# EAGLE design geigerCounter (EAGLE 5.11)
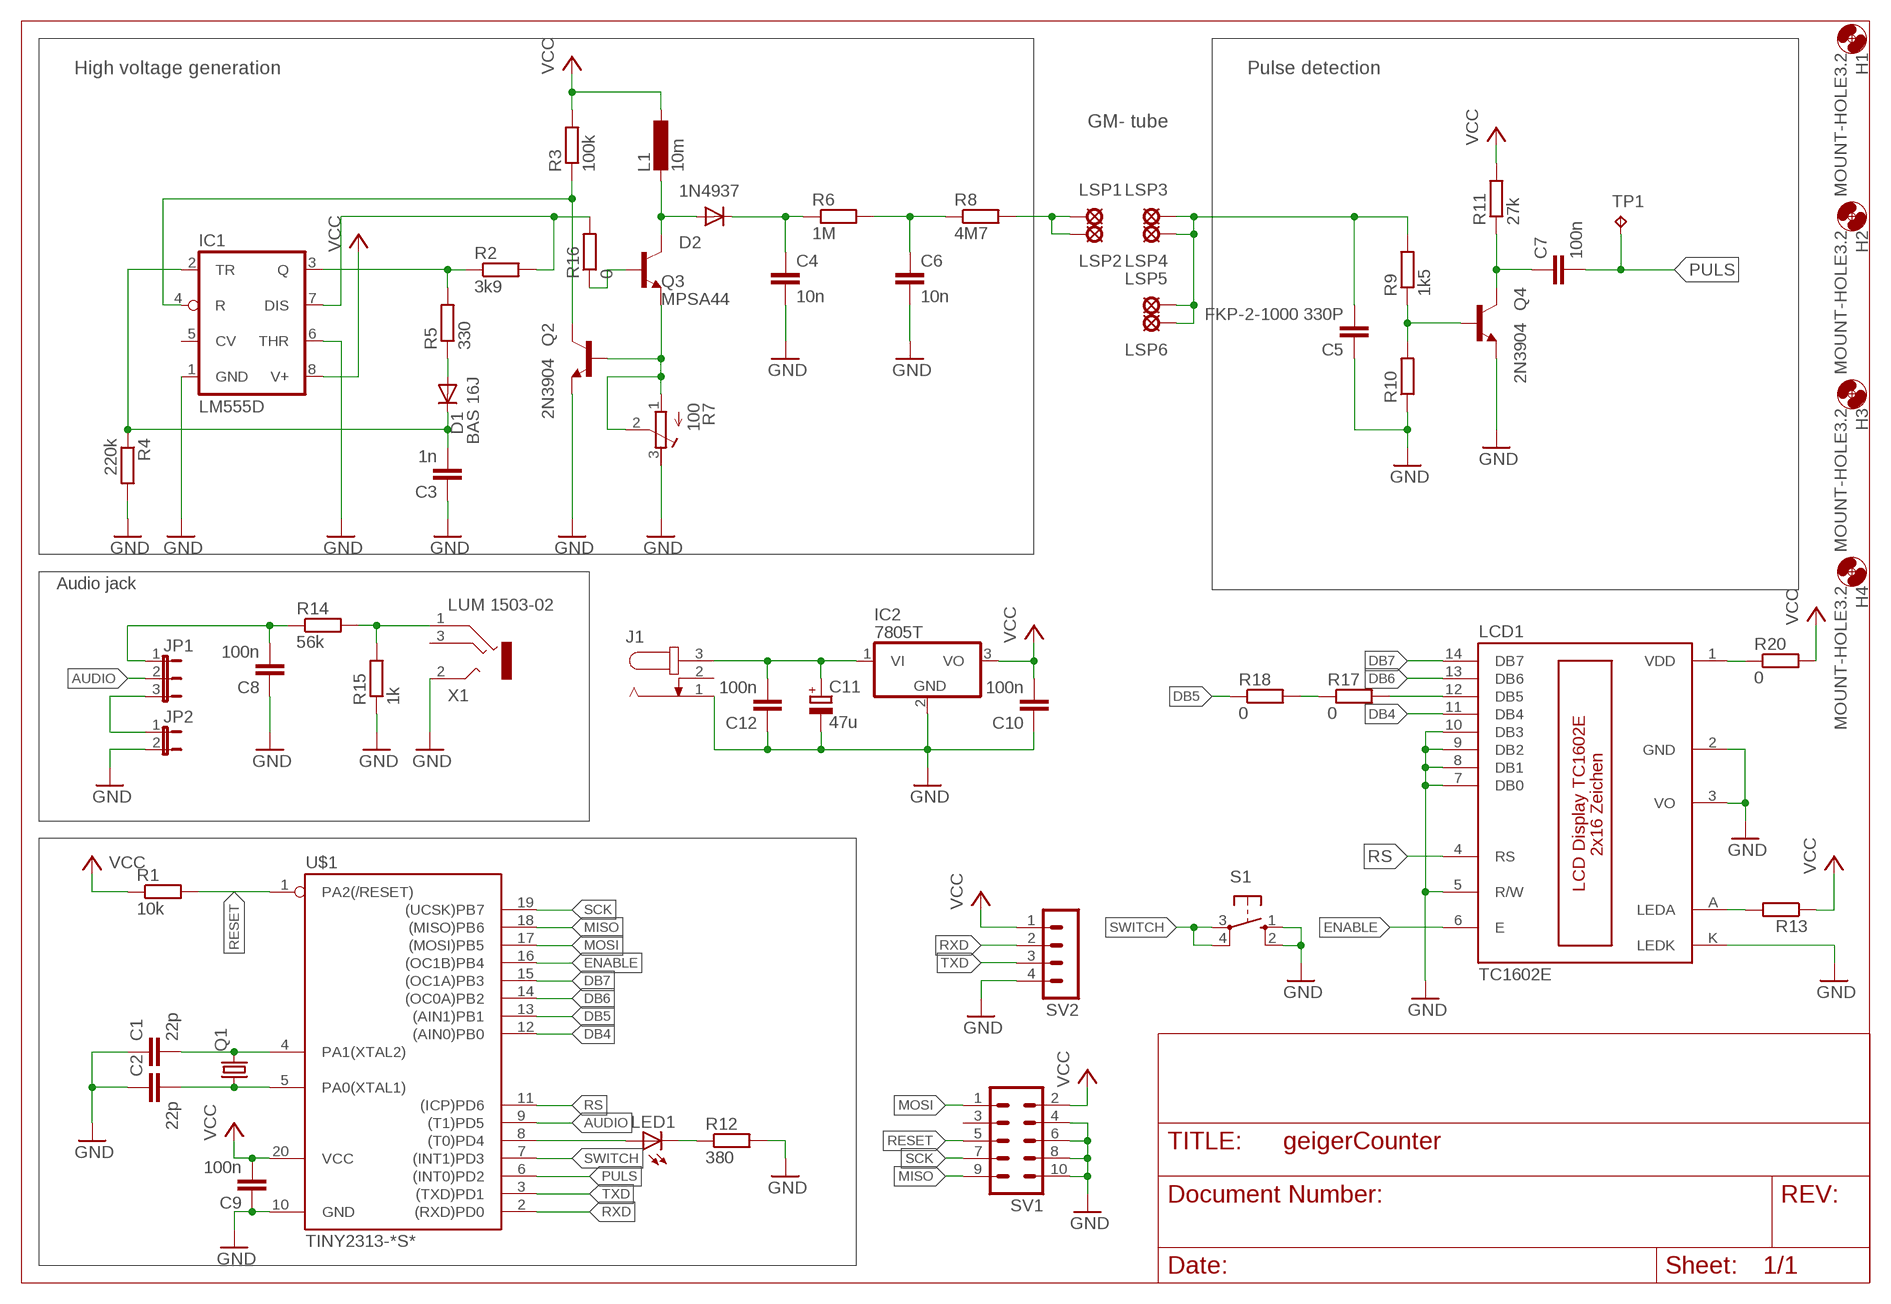
[diagram p0: schematic, sheet 1]

## Parts
C1  22p  C-EUC0805  [C0805]
C2  22p  C-EUC0805  [C0805]
C3  1n  C-EUC0805  [C0805]
C4  10n  C15/7  [C15B7]
C5  FKP-2-1000 330P  C5/5  [C5B5]
C6  10n  C15/7  [C15B7]
C7  100n  C-EUC0805  [C0805]
C8  100n  C-EUC0805  [C0805]
C9  100n  C-EUC0805  [C0805]
C10  100n  C-EUC0805  [C0805]
C11  47u  CPOL-EUUD-5X5,8  [UD-5X5,8_NICHICON]
C12  100n  C-EUC0805  [C0805]
D1  BAS 16J  DIODE-SOD323-W  [SOD323-W]
D2  1N4937  1N4942  [DO41-10]
H1  MOUNT-HOLE3.2  [3,2]
H2  MOUNT-HOLE3.2  [3,2]
H3  MOUNT-HOLE3.2  [3,2]
H4  MOUNT-HOLE3.2  [3,2]
IC1  LM555D  [SO08]
IC2  7805T  [TO220H]
J1  JACK-PLUG1  [SPC4078]
JP1  JP2E  [JP2]
JP2  JP1E  [JP1]
L1  10m  L-EU0207/5V  [0207/5V]
LCD1  TC1602E  [TC1602E]
LED1  LEDCHIP-LED0805  [CHIP-LED0805]
LSP1  PL 120000  SE14  [SE14]
LSP2  PL 120000  SE14  [SE14]
LSP3  PL 120000  SE14  [SE14]
LSP4  PL 120000  SE14  [SE14]
LSP5  PL 120000  SE14  [SE14]
LSP6  PL 120000  SE14  [SE14]
Q1  CRYSTALHC49UP  [HC49UP]
Q2  2N3904  [TO92]
Q3  MPSA44  2N3904  [TO92]
Q4  2N3904  [TO92]
R1  10k  R-EU_R0805  [R0805]
R2  3k9  R-EU_R0805  [R0805]
R3  100k  R-EU_R0805  [R0805]
R4  220k  R-EU_R0805  [R0805]
R5  330  R-EU_R0805  [R0805]
R6  1M  R-EU_0204/7  [0204/7]
R7  100  R-TRIMM64Y  [RTRIM64Y]
R8  4M7  R-EU_0204/7  [0204/7]
R9  1k5  R-EU_0204/7  [0204/7]
R10  R-EU_0204/7  [0204/7]
R11  27k  R-EU_R0805  [R0805]
R12  380  R-EU_R0805  [R0805]
R13  R-EU_R0805  [R0805]
R14  56k  R-EU_R0805  [R0805]
R15  1k  R-EU_R0805  [R0805]
R16  0  R-EU_R0805  [R0805]
R17  0  R-EU_R0805  [R0805]
R18  0  R-EU_R0805  [R0805]
R20  0  R-EU_R0805  [R0805]
S1  10-XX  [B3F-10XX]
SV1  MA05-2  [MA05-2]
SV2  MA04-1  [MA04-1]
TP1  TPTP15SQ  [TP15SQ]
U$1  TINY2313-*S*  [SO20L$]
X1  LUM 1503-02  1503_02  [1503_02]

## Nets
$345: C7.1 Q4.1(C) R11.1
AUDIO: JP1.2 U$1.9((T1)PD5)
DB4: LCD1.11(DB4) U$1.12((AIN0)PB0)
DB5: R18.1 U$1.13((AIN1)PB1)
DB6: LCD1.13(DB6) U$1.14((OC0A)PB2)
DB7: LCD1.14(DB7) U$1.15((OC1A)PB3)
ENABLE: LCD1.6(E) U$1.16((OC1B)PB4)
GND: C1.1 C2.1 C3.1 C4.2 C5.1 C6.2 C8.1 C9.1 C10.1 C11.- C12.1 IC1.1(GND) IC1.6(THR) IC2.2(GND) J1.1 JP2.2 LCD1.2(GND) LCD1.3(VO) LCD1.5(R/W) LCD1.7(DB0) LCD1.8(DB1) LCD1.9(DB2) LCD1.10(DB3) LCD1.K(LEDK) Q2.3(E) Q4.3(E) R4.2 R7.3(A) R10.1 R12.2 R15.1 S1.1(S) S1.2(S1) SV1.4 SV1.6 SV1.8 SV1.10 SV2.4 U$1.10(GND) X1.2
MISO: SV1.9 U$1.18((MISO)PB6)
MOSI: SV1.1 U$1.17((MOSI)PB5)
N$1: C6.1 R6.2 R8.1
N$2: IC1.3(Q) R2.1 R5.2
N$3: LCD1.A(LEDA) R13.2
N$4: LED1.A U$1.8((T0)PD4)
N$5: IC1.7(DIS) R2.2 R16.2
N$6: IC1.4(R) Q2.1(C) R3.1
N$7: LED1.C R12.1
N$8: D1.A R5.1
N$9: JP1.3 JP2.1
N$10: LSP1.MP LSP2.MP R8.2
N$11: C5.2 LSP3.MP LSP4.MP LSP5.MP LSP6.MP R9.2
N$12: Q4.2(B) R9.1 R10.2
N$13: D2.A L1.2 Q3.1(C)
N$14: Q2.2(B) Q3.3(E) R7.1(E) R7.2(S)
N$16: C8.2 JP1.1 R14.1
N$17: C4.1 D2.C R6.1
N$18: C3.2 D1.C IC1.2(TR) R4.1
N$19: C2.2 Q1.1 U$1.5(PA0(XTAL1))
N$20: C1.2 Q1.2 U$1.4(PA1(XTAL2))
N$21: C11.+ C12.2 IC2.1(VI) J1.3
N$22: R14.2 R15.2 X1.1
N$23: Q3.2(B) R16.1
N$24: LCD1.12(DB5) R17.2
N$25: R17.1 R18.2
N$26: LCD1.1(VDD) R20.1
PULS: C7.2 TP1.TP U$1.6((INT0)PD2)
RESET: R1.2 SV1.5 U$1.1(PA2(/RESET))
RS: LCD1.4(RS) U$1.11((ICP)PD6)
RXD: SV2.2 U$1.2((RXD)PD0)
SCK: SV1.7 U$1.19((UCSK)PB7)
SWITCH: S1.3(P) S1.4(P1) U$1.7((INT1)PD3)
TXD: SV2.3 U$1.3((TXD)PD1)
VCC: C9.2 C10.2 IC1.8(V+) IC2.3(VO) L1.1 R1.1 R3.2 R11.2 R13.1 R20.2 SV1.2 SV2.1 U$1.20(VCC)
Unconnected: IC1.5(CV) J1.2 SV1.3 X1.2@2 X1.3

## Notes on the sheet
- High voltage generation | Pulse detection
- GM- tube
- Audio jack

## Library data of the parts
C1-C3 C7-C10 C12 = rcl:C-EU: CAPACITOR, European symbol
C4-C6 = capacitor-wima:C: CAPACITOR naming: grid - package width
C11 = rcl:CPOL-EU: POLARIZED CAPACITOR, European symbol
D1 = diode:DIODE-: DIODE
D2 = diode:1N4942: DIODE 1.0 A, 200 V, 150 ns
H1-H4 = holes:MOUNT-HOLE: MOUNTING HOLE with drill center marker
IC1 = linear:*555: TIMER
IC2 = linear:78*: Positive VOLTAGE REGULATOR Source: http://cache.national.com/ds/LM/LM78L05.pdf http://www.fairchildsemi.com/ds/LM/LM7805.pdf
J1 = con-jack:JACK-PLUG: DC POWER JACK Power Jack, DC, Right Angle, Through Hole, Rated 5A at 16VDC, PC Terminals Distributor: Farnell (www.Farnell.de) Drawing: 84N1161.pdf / 84N1162.pdf Manufacturer: SPC Technology (www.spctechnology.com) Type: SPC4077 / SPC 4078; OC_FARNELL: unknown; OC_NEWARK: unknown
JP1 = jumper:JP2E: JUMPER
JP2 = jumper:JP1E: JUMPER
L1 = rcl:L-EU: INDUCTOR, European symbol
LCD1 = tc1602e_l:TC1602E: LCD Anzeige TC1602E(L) © Dipl. Päd. Otmar Hettrich-Keller 11/08 o.hettrich-keller@htl-leonding.ac.at Datenblatt: http://www.lcd-module.de/deu/pdf/doma/dip162-d.pdf
LED1 = led:LED: LED OSRAM: - CHIPLED LG R971, LG N971, LY N971, LG Q971, LY Q971, LO R971, LY R971 LH N974, LH R974 LS Q976, LO Q976, LY Q976 LO Q996 - Hyper CHIPLED LW Q18S LB Q993, LB Q99A, LB R99A - SideLED LS A670, LO A670, LY A670, LG A670, LP A670 LB A673, LV A673, LT A673, LW A673 LH A674 LY A675 LS A676, LA A676, LO A676, LY A676, LW A676 LS A679, LY A679, LG A679 - Hyper Micro SIDELED® LS Y876, LA Y876, LO Y876, LY Y876 LT Y87S - SmartLED LW L88C, LW L88S LB L89C, LB L89S, LG L890 LS L89K, LO L89K, LY L89K LS L896, LA L896, LO L896, LY L896 - TOPLED LS T670, LO T670, LY T670, LG T670, LP T670 LSG T670, LSP T670, LSY T670, LOP T670, LYG T670 LG T671, LOG T671, LSG T671 LB T673, LV T673, LT T673, LW T673 LH T674 LS T676, LA T676, LO T676, LY T676, LB T676, LH T676, LSB T676, LW T676 LB T67C, LV T67C, LT T67C, LS T67K, LO T67K, LY T67K, LW E67C LS E67B, LA E67B, LO E67B, LY E67B, LB E67C, LV E67C, LT E67C LW T67C LS T679, LY T679, LG T679 LS T770, LO T770, LY T770, LG T770, LP T770 LB T773, LV T773, LT T773, LW T773 LH T774 LS E675, LA E675, LY E675, LS T675 LS T776, LA T776, LO T776, LY T776, LB T776 LHGB T686 LT T68C, LB T68C - Hyper Mini TOPLED® LB M676 - Mini TOPLED Santana® LG M470 LS M47K, LO M47K, LY M47K Source: http://www.osram.convergy.de LUXEON: - LUMILED® LXK2-PW12-R00, LXK2-PW12-S00, LXK2-PW14-U00, LXK2-PW14-V00 LXK2-PM12-R00, LXK2-PM12-S00, LXK2-PM14-U00 LXK2-PE12-Q00, LXK2-PE12-R00, LXK2-PE12-S00, LXK2-PE14-T00, LXK2-PE14-U00 LXK2-PB12-K00, LXK2-PB12-L00, LXK2-PB12-M00, LXK2-PB14-N00, LXK2-PB14-P00, LXK2-PB14-Q00 LXK2-PR12-L00, LXK2-PR12-M00, LXK2-PR14-Q00, LXK2-PR14-R00 LXK2-PD12-Q00, LXK2-PD12-R00, LXK2-PD12-S00 LXK2-PH12-R00, LXK2-PH12-S00 LXK2-PL12-P00, LXK2-PL12-Q00, LXK2-PL12-R00 Source: www.luxeon.com KINGBRIGHT: KA-3528ASYC Source: www.kingbright.com
LSP1-LSP6 = solpad:SE14: SOLDER PAD E1553, drill 1,4mm, distributor Buerklin, 07F820
Q1 = crystal:CRYSTAL: CRYSTAL; OC_FARNELL: unknown; OC_NEWARK: unknown
Q2-Q4 = transistor-npn:2N3904: NPN Transistor
R1-R6 R8-R18 R20 = rcl:R-EU_: RESISTOR, European symbol
R7 = rcl:R-TRIMM: Trimm resistor
S1 = switch-omron:10-XX: OMRON SWITCH; MPN: B3F-1000; OC_FARNELL: 176432; OC_NEWARK: 36M3542
SV1 = con-lstb:MA05-2: PIN HEADER; OC_FARNELL: unknown; OC_NEWARK: unknown
SV2 = con-lstb:MA04-1: PIN HEADER; OC_FARNELL: unknown; OC_NEWARK: unknown
TP1 = testpad:TP: Test pad
U$1 = avr-7:TINY2313*: Atmel Tiny2313 2K Flash, 128 bytes EEPROM, 128 bytes RAM
X1 = con-lumberg:1503_02: Jack connectors according to JISC 6560, 3.5 mm Klinkeneinbaukupplung nach JISC 6560, 3,5 mm, 3-polig/stereo, abgewinkelte Ausführung, Surface-Mount-Technik (SMT) Source: http://www.lumberg.com/Produkte/PDFs/1503_02.pdf; OC_FARNELL: 1216979; OC_NEWARK: unknown

## Board
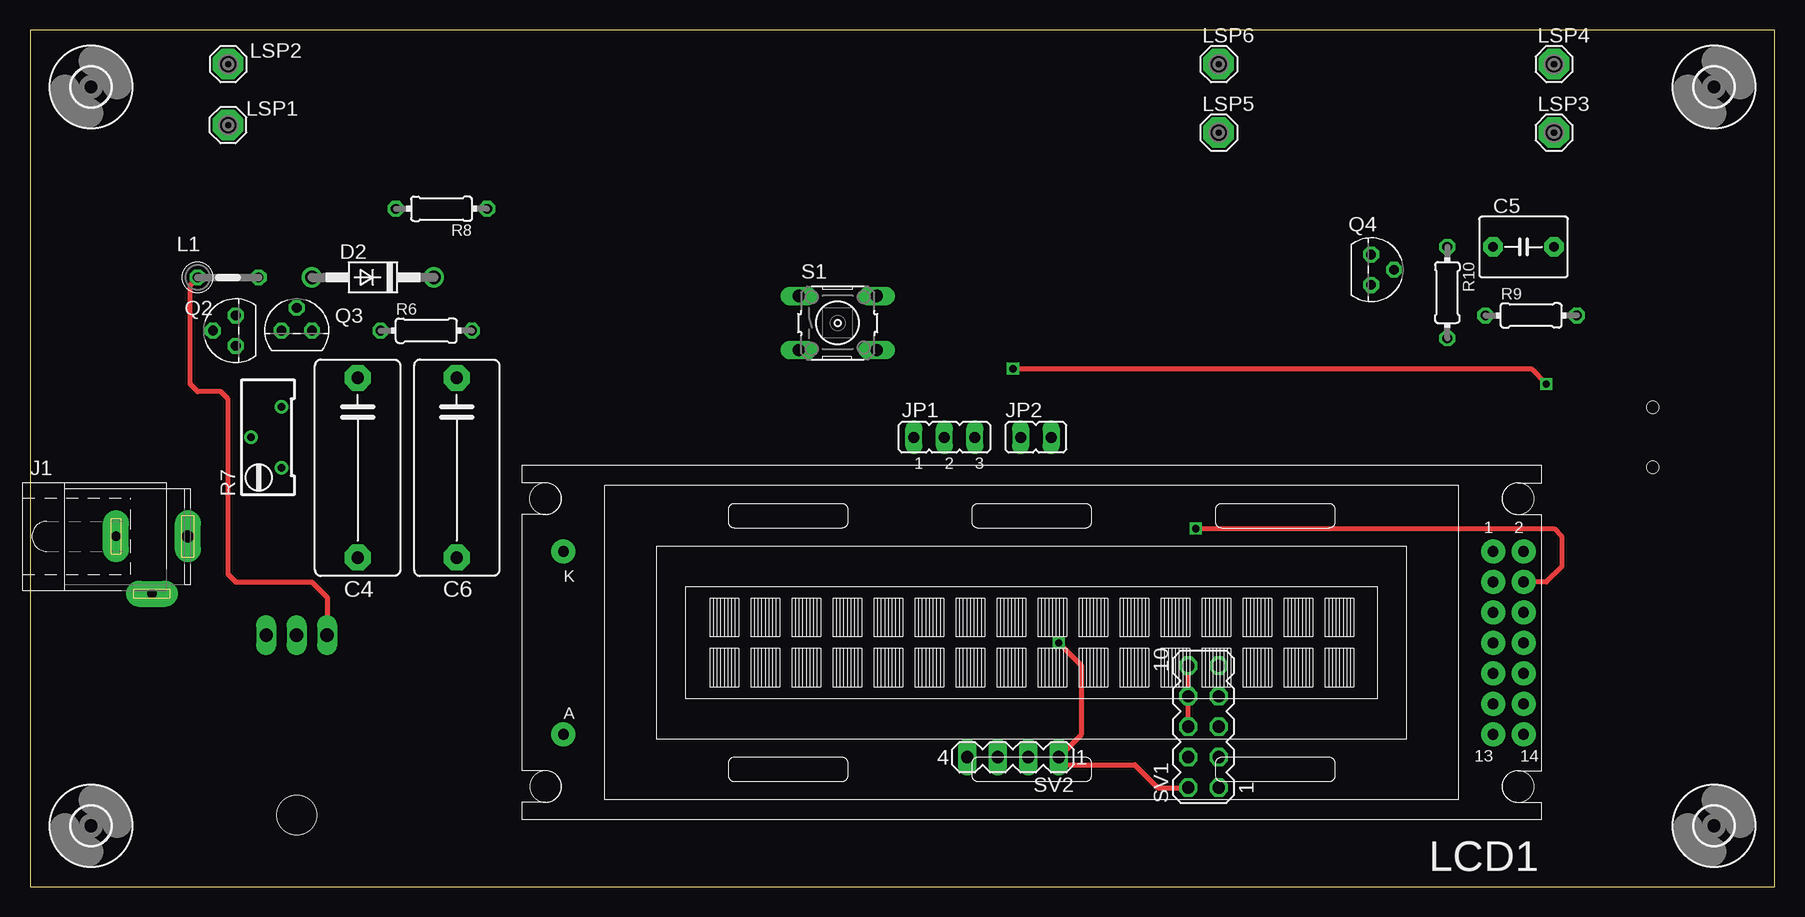
[diagram p1: board, top side]
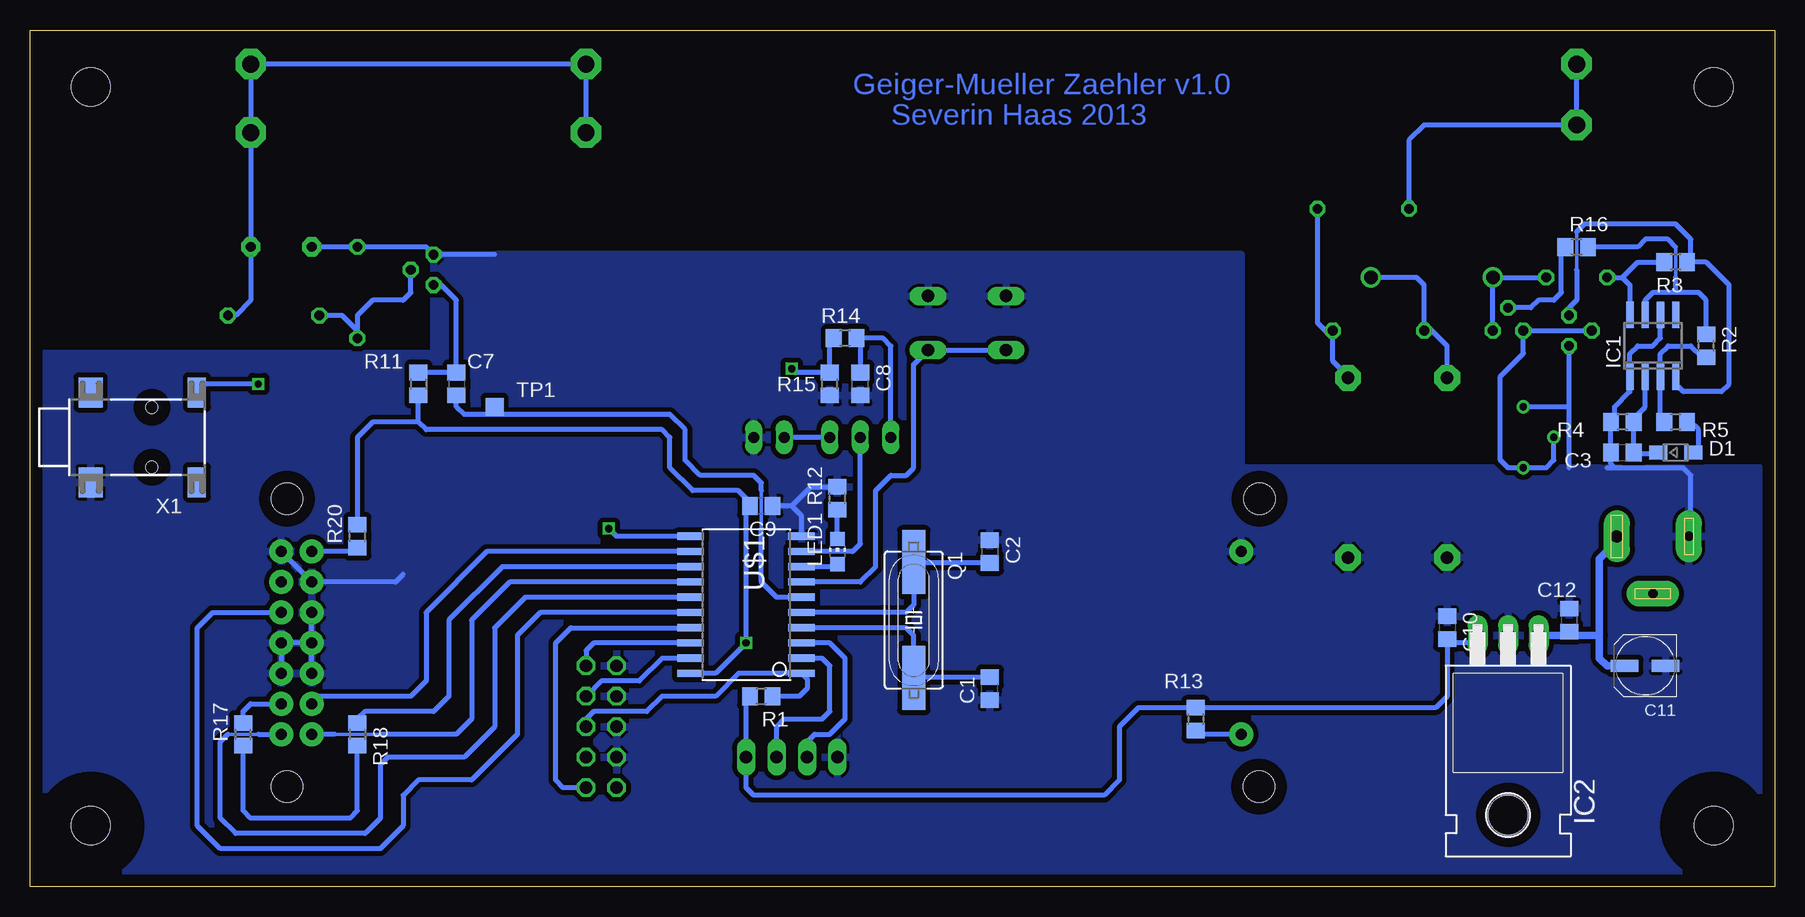
[diagram p2: board, bottom side, seen from below]

Size 145.4 x 71.42 mm. Coordinates in mm from the lower left corner, seen from the top.
Outline: 0,0 145.4,0 145.4,71.42 0,71.42 0,0
Copper layers (1*16): Top 0.035mm / dielectric 1.5mm / Bottom 0.035mm
Design rules "default": minimum track width 10mil, minimum drill 24mil, track to track 8mil, track to pad 8mil, pad to pad 8mil, via to via 8mil, smd to smd 8mil, copper to edge 40mil, drill to drill 8mil, minimum pad ring 10mil, minimum via ring 8mil, stop-mask expansion 4mil, vias tented up to drill 0mil, thermal gap 10mil

### Footprints (pad centres in the part's own frame; a part is rotated, then mirrored left to right if it is on the bottom)
C0805 = smd 1.3 x 1.5: 1 -0.95,0; 2 0.95,0
C15B7 = drill 1.016 pad 2.159 octagon: 1 -7.493,0; 2 7.493,0
C5B5 = drill 0.813 pad 1.6 octagon: 1 -2.54,0; 2 2.54,0
UD-5X5,8_NICHICON = smd 2.3 x 1: + 1.725,0; - -1.7,0
SOD323-W = smd 1.5 x 1.2: A 1.45,0; C -1.45,0
DO41-10 = drill 1.118 round: A 5.08,0; C -5.08,0
3,2 = hole 3.2: 0,0
SO08 = smd 0.6 x 2.2: 1 -1.905,-2.6; 2 -0.635,-2.6; 3 0.635,-2.6; 4 1.905,-2.6; 5 1.905,2.6; 6 0.635,2.6; 7 -0.635,2.6; 8 -1.905,2.6
TO220H = drill 1.118 long: 1 -2.54,-10.16; 2 0,-10.16; 3 2.54,-10.16 | hole 3.302: 0,4.826
SPC4078 = drill 0.8 pad 2.184 long: 1 -3,0; 2 0,-4.8 | drill 1 pad 2.184 long: 3 3,0
JP2 = drill 0.914 long: 1 -2.54,0; 2 0,0; 3 2.54,0
JP1 = drill 0.914 long: 1 0,-1.27; 2 0,1.27
0207/5V = drill 0.813 octagon: 1 -2.54,0; 2 2.54,0
TC1602E = drill 0.9 pad 2 round: 1 -38.1,-7.62; 2 -40.64,-7.62; 3 -38.1,-5.08; 4 -40.64,-5.08; 5 -38.1,-2.54; 6 -40.64,-2.54; 7 -38.1,0; 8 -40.64,0; 9 -38.1,2.54; 10 -40.64,2.54; 11 -38.1,5.08; 12 -40.64,5.08; 13 -38.1,7.62; 14 -40.64,7.62; A 39.37,7.62; K 39.37,-7.62 | hole 2.6: -40.172,11.976; -40.172,-12.026; 40.871,-12.026; 40.84,11.976
CHIP-LED0805 = smd 1.2 x 1.2: A 0,-1.05; C 0,1.05
SE14 = drill 1.397 pad 2.54 octagon: MP 0,0
HC49UP = smd 5.334 x 1.93: 1 -4.826,0; 2 4.826,0
TO92 = drill 0.813 octagon: 1 1.27,0; 2 0,1.905; 3 -1.27,0
R0805 = smd 1.3 x 1.5: 1 -0.95,0; 2 0.95,0
0204/7 = drill 0.813 octagon: 1 -3.81,0; 2 3.81,0
RTRIM64Y = drill 0.61 round: 1 0,-2.54; 2 -2.54,0; 3 0,2.54
B3F-10XX = drill 1.016 long: 1 -3.251,2.261; 2 3.251,2.261; 3 -3.251,-2.261; 4 3.251,-2.261
MA05-2 = drill 1.016 octagon: 1 -5.08,-1.27; 2 -5.08,1.27; 3 -2.54,-1.27; 4 -2.54,1.27; 5 0,-1.27; 6 0,1.27; 7 2.54,-1.27; 8 2.54,1.27; 9 5.08,-1.27; 10 5.08,1.27
MA04-1 = drill 1.016 long: 1 -3.81,0; 2 -1.27,0; 3 1.27,0; 4 3.81,0
TP15SQ = smd 1.5 x 1.5: TP 0,0
SO20L$ = smd 0.61 x 2.21: 1 -5.715,-4.636; 2 -4.445,-4.636; 3 -3.175,-4.636; 4 -1.905,-4.636; 5 -0.635,-4.636; 6 0.635,-4.636; 7 1.905,-4.636; 8 3.175,-4.636; 9 4.445,-4.636; 10 5.715,-4.636; 11 5.715,4.61; 12 4.445,4.636; 13 3.175,4.636; 14 1.905,4.636; 15 0.635,4.636; 16 -0.635,4.636; 17 -1.905,4.636; 18 -3.175,4.636; 19 -4.445,4.636; 20 -5.715,4.636
1503_02 = smd 2.5 x 1.5: 1 3.75,-10.75; 3 -3.75,-10.75 | smd 2.5 x 2: 2 -3.75,-1.9; 2@2 3.75,-1.9 | hole 1: -2.5,-7; 2.5,-7

### Placement (x,y rotation side)
C1  65.41,16.51 90 bottom
C2  65.41,27.94 270 bottom
C3  12.7,36.2 0 bottom
C4  27.3,34.92 270 top
C5  124.46,53.34 0 top
C6  35.56,34.92 270 top
C7  109.86,41.91 270 bottom
C8  76.2,41.91 90 bottom
C9  84.45,31.75 180 bottom
C10  27.3,21.59 270 bottom
C11  10.79,18.41 180 bottom
C12  17.14,22.23 270 bottom
D1  8.26,36.2 0 bottom
D2  28.57,50.8 180 top
H1  140.34,66.67 0 top
H2  140.34,5.08 0 top
H3  5.08,66.67 0 top
H4  5.08,5.08 0 top
IC1  10.16,45.09 0 bottom
IC2  22.23,10.79 180 bottom
J1  10.16,29.21 0 top
JP1  76.2,37.47 0 top
JP2  83.82,37.47 270 top
L1  16.51,50.8 0 top
LCD1  83.82,20.32 180 top
LED1  78.11,27.94 0 bottom
LSP1  16.51,63.5 180 top
LSP2  16.51,68.58 0 top
LSP3  127,62.87 0 top
LSP4  127,68.58 0 top
LSP5  99.06,62.87 0 top
LSP6  99.06,68.58 0 top
Q1  71.75,22.23 270 bottom
Q2  17.14,46.35 90 top
Q3  22.23,46.35 0 top
Q4  111.76,51.44 270 top
R1  84.45,15.88 0 bottom
R2  5.71,45.09 90 bottom
R3  8.26,52.07 180 bottom
R4  12.7,38.73 180 bottom
R5  8.26,38.73 180 bottom
R6  33.02,46.35 0 top
R7  20.95,37.47 0 top
R8  34.29,56.52 180 top
R9  125.09,47.62 0 top
R10  118.11,49.53 270 top
R11  113.03,41.91 270 bottom
R12  78.11,32.38 90 bottom
R13  48.26,13.97 270 bottom
R14  77.47,45.72 180 bottom
R15  78.74,41.91 90 bottom
R16  16.51,53.34 0 bottom
R17  127.64,12.7 90 bottom
R18  118.11,12.7 270 bottom
R20  118.11,29.21 90 bottom
S1  67.31,46.99 0 top
SV1  97.79,13.34 90 top
SV2  81.92,10.79 180 top
TP1  106.68,40.01 0 bottom
U$1  85.72,23.5 90 bottom
X1  142.24,37.47 90 bottom

### Tracks (layer width: path | path; a pad name or v marks a point on that pad's centre or on a via)
$345
  Bottom 0.406: R11.1 C7.1 109.86,48.9 111.12,50.16 Q4.1
AUDIO
  Bottom 0.406: U$1.9 76.83,27.94 76.2,28.57 JP1.2
DB4
  Bottom 0.406: U$1.12 107.31,27.94 112.39,22.86 112.39,17.14 113.67,15.88 121.28,15.88 LCD1.11
DB5
  Bottom 0.406: U$1.13 106.05,26.67 110.49,22.23 110.49,15.88 111.76,14.61 117.47,14.61 118.11,13.97 R18.1
DB6
  Bottom 0.305: 116.2,12.7 120.02,12.7
  Bottom 0.406: U$1.14 105.41,25.4 108.58,22.23 108.58,13.97 109.86,12.7 116.2,12.7 | 120.02,12.7 LCD1.13
DB7
  Bottom 0.305: 128.91,12.7 126.36,12.7
  Bottom 0.406: U$1.15 104.14,24.13 106.68,21.59 106.68,13.34 109.22,10.79 115.57,10.79 116.2,10.16 116.2,5.71 117.47,4.45 128.27,4.45 129.54,5.71 129.54,12.06 128.91,12.7 | 126.36,12.7 LCD1.14
ENABLE
  Bottom 0.406: U$1.16 102.87,22.86 104.78,20.95 104.78,12.7 108.58,8.89 113.03,8.89 114.3,7.62 114.3,5.08 116.2,3.17 129.54,3.17 131.44,5.08 131.44,21.59 130.18,22.86 LCD1.6
GND
  Top 0.406: SV1.10 SV1.8 SV1.6
  Bottom 0.406: IC1.6 9.53,45.72 10.16,45.09 11.43,45.09 12.06,44.45 IC1.1 12.06,41.27 13.34,40.01 13.34,39.05 R4.2 C3.1 13.65,35.24 13.34,34.92 | U$1.10 81.09,30.92 81.92,31.75 | 81.92,31.75 C9.1 | R12.2 80.33,33.34 81.92,31.75 | LCD1.2 LCD1.3 114.94,25.4 114.3,26.04 | C5.1 R10.1 112.39,53.34 Q4.3 106.68,52.7 | 17.14,34.92 17.14,40.01 | 17.14,40.01 Q2.3 | 17.14,40.01 R7.3 | 13.34,34.92 13.97,34.92 | 13.34,34.92 7.62,34.92 6.99,34.29 6.99,29.39 J1.1 | LCD1.10 LCD1.8 LCD1.7 | LCD1.9 LCD1.7 | LCD1.7 LCD1.5
  pour Bottom (isolate 0.406): 0.64,1.27 144.78,1.27 144.78,44.45 111.76,44.45 111.76,52.7 44.45,52.7 44.45,34.92 1.27,34.92
MISO
  Bottom 0.406: SV1.9 99.06,19.68 98.42,20.32 U$1.18
MOSI
  Bottom 0.406: U$1.17 100.33,21.59 101.6,20.32 101.6,8.89 100.97,8.26 SV1.1
N$1
  Bottom 0.406: C6.1 35.56,42.55 36.83,43.81 R6.2 37.47,46.35 38.1,46.99 R8.1
N$2
  Bottom 0.406: R2.1 6.04,44.13 6.99,45.09 8.89,45.09 9.53,44.45 IC1.3 9.53,39.05 R5.2
N$3
  Bottom 0.406: LCD1.A 47.94,12.7 R13.2
N$4
  Bottom 0.406: U$1.8 78.33,26.67 LED1.A
N$5
  Bottom 0.305: 8.26,50.8 8.26,53.34
  Bottom 0.406: R2.2 5.71,48.9 6.35,49.53 8.26,49.53 | IC1.7 10.79,48.9 10.16,49.53 8.26,49.53 | 8.26,49.53 8.26,50.8 | 8.26,53.34 8.89,53.98 10.79,53.98 11.43,53.34 R16.2
N$6
  Bottom 0.305: 16.51,54.61 16.51,51.44
  Bottom 0.406: IC1.4 8.26,41.91 7.62,41.27 4.45,41.27 3.81,41.91 3.81,50.16 5.71,52.07 R3.1 6.99,52.39 6.99,53.98 8.26,55.24 15.88,55.24 16.51,54.61 | Q2.1 17.14,48.26 16.51,48.9 16.51,51.44
N$7
  Bottom 0.406: LED1.C R12.1
N$8
  Bottom 0.406: R5.1 6.99,38.73 6.35,38.1 6.35,36.65 D1.A
N$9
  Bottom 0.406: JP1.3 JP2.1
N$10
  Bottom 0.406: 15.88,69.22 LSP2.MP LSP1.MP 29.21,63.5 30.48,62.23 R8.2
N$11
  Bottom 0.406: R9.2 128.27,47.62 127,48.9 C5.2 LSP3.MP LSP4.MP LSP6.MP LSP5.MP
N$12
  Bottom 0.406: 118.11,46.35 R10.2 | 118.11,46.35 119.38,47.62 R9.1 | Q4.2 113.67,49.53 114.3,48.9 116.84,48.9 118.11,47.62 118.11,46.35
N$13
  Bottom 0.406: L1.2 D2.A Q3.1
N$14
  Bottom 0.406: Q2.2 Q3.3 20.95,44.45 22.86,42.55 22.86,35.56 22.23,34.92 R7.1 19.05,34.92 18.41,35.56 R7.2
N$16
  Bottom 0.406: JP1.1 73.66,45.09 74.3,45.72 R14.1 76.2,45.4 C8.2
N$17
  Bottom 0.406: C4.1 27.3,45.09 28.57,46.35 R6.1 29.21,50.16 29.84,50.8 D2.C
N$18
  Bottom 0.406: IC1.2 10.79,40.01 11.43,39.37 11.43,39.05 R4.1 C3.2 11.61,36.05 9.85,36.05 D1.C
N$19
  Bottom 0.406: U$1.5 72.39,22.86 71.75,23.5 Q1.1 71.69,26.99 C2.2
N$20
  Bottom 0.406: U$1.4 72.39,21.59 71.75,20.95 Q1.2 71.69,17.46 C1.2
N$21
  Bottom 0.61: J1.3 13.16,28.75 14.61,27.3 14.61,20.95 | C11.+ 13.97,18.41 14.61,19.05 14.61,20.95 | IC2.1 17.46,20.95 C12.2 16.82,20.95 14.61,20.95
N$22  (via drill 0.6)
  Top 0.406: v81.92,43.18 125.09,43.18 v126.36,41.91
  Bottom 0.406: R14.2 78.74,45.4 R15.2 81.59,42.86 v81.92,43.18 | v126.36,41.91 130.79,41.91 X1.1
N$23
  Bottom 0.406: Q3.2 20.32,48.26 19.68,48.9 18.41,48.9 17.78,49.53 17.78,53.02 R16.1
N$24
  Bottom 0.406: LCD1.12 127,15.24 127.64,14.61 R17.2
N$25
  Bottom 0.406: R17.1 127.64,6.35 127,5.71 118.75,5.71 118.11,6.35 R18.2
N$26
  Bottom 0.406: R20.1 118.11,27.94 LCD1.1
PULS
  Bottom 0.305: 84.45,29.84 84.45,33.02
  Bottom 0.406: U$1.6 83.19,24.13 84.45,25.4 84.45,29.84 | C7.2 109.86,40.01 109.22,39.37 106.68,39.37 | 84.45,33.02 84.45,33.66 85.09,34.29 89.53,34.29 90.81,35.56 90.81,38.1 92.08,39.37 106.68,39.37 | 106.68,39.37 TP1.TP
RESET
  Bottom 0.406: SV1.5 99.06,13.97 98.42,14.61 93.98,14.61 92.71,15.88 88.27,15.88 86.36,17.78 U$1.1 80.64,17.34 80.64,16.51 81.28,15.88 R1.2
RS  (via drill 0.6)
  Top 0.406: v97.16,29.84 127,29.84 127.64,29.21 127.64,26.67 126.36,25.4 LCD1.4
  Bottom 0.406: U$1.11 96.52,29.21 v97.16,29.84
RXD
  Bottom 0.406: U$1.2 79.38,19.05 78.74,18.41 78.74,14.61 79.38,13.97 82.55,13.97 83.19,13.34 SV2.2
SCK
  Bottom 0.406: U$1.19 92.71,19.05 94.61,17.14 97.79,17.14 SV1.7
SWITCH
  Bottom 0.406: U$1.7 76.2,25.4 74.93,26.67 74.93,33.02 73.66,34.29 72.39,34.29 71.75,34.92 71.75,43.54 S1.4 S1.3
TXD
  Bottom 0.406: U$1.3 78.74,20.32 77.47,19.05 77.47,13.97 78.74,12.7 80.01,12.7 80.64,12.06 SV2.3
VCC  (via drill 0.6)
  Top 0.406: SV1.2 93.98,8.26 92.08,10.16 86.36,10.16 v85.72,10.79 87.63,12.7 87.63,18.41 v85.72,20.32 | IC2.3 24.77,24.13 23.5,25.4 17.14,25.4 16.51,26.04 16.51,40.64 15.88,41.27 13.97,41.27 13.34,41.91 13.34,50.16 L1.1
  Bottom 0.406: L1.1 12.7,50.8 | 12.7,50.8 12.06,50.16 IC1.8 | R1.1 85.72,15.55 v85.72,10.79 85.72,8.26 85.09,7.62 55.88,7.62 54.61,8.89 54.61,13.34 53.02,14.92 R13.1 28.26,14.92 27.3,15.88 C10.2 26.98,20.32 24.77,20.32 IC2.3 | R3.2 11.43,52.07 12.7,50.8 | U$1.20 88.27,17.78 v85.72,20.32 85.72,31.43 C9.2 85.41,32.06 86.36,33.02 90.17,33.02 92.08,34.92 92.08,37.47 92.71,38.1 112.39,38.1 113.03,38.73 | 113.03,38.73 R11.2 | R20.2 118.11,37.47 116.84,38.73 113.03,38.73

### Text on the board
Bottom: Geiger-Mueller Zaehler v1.0 | Severin Haas 2013